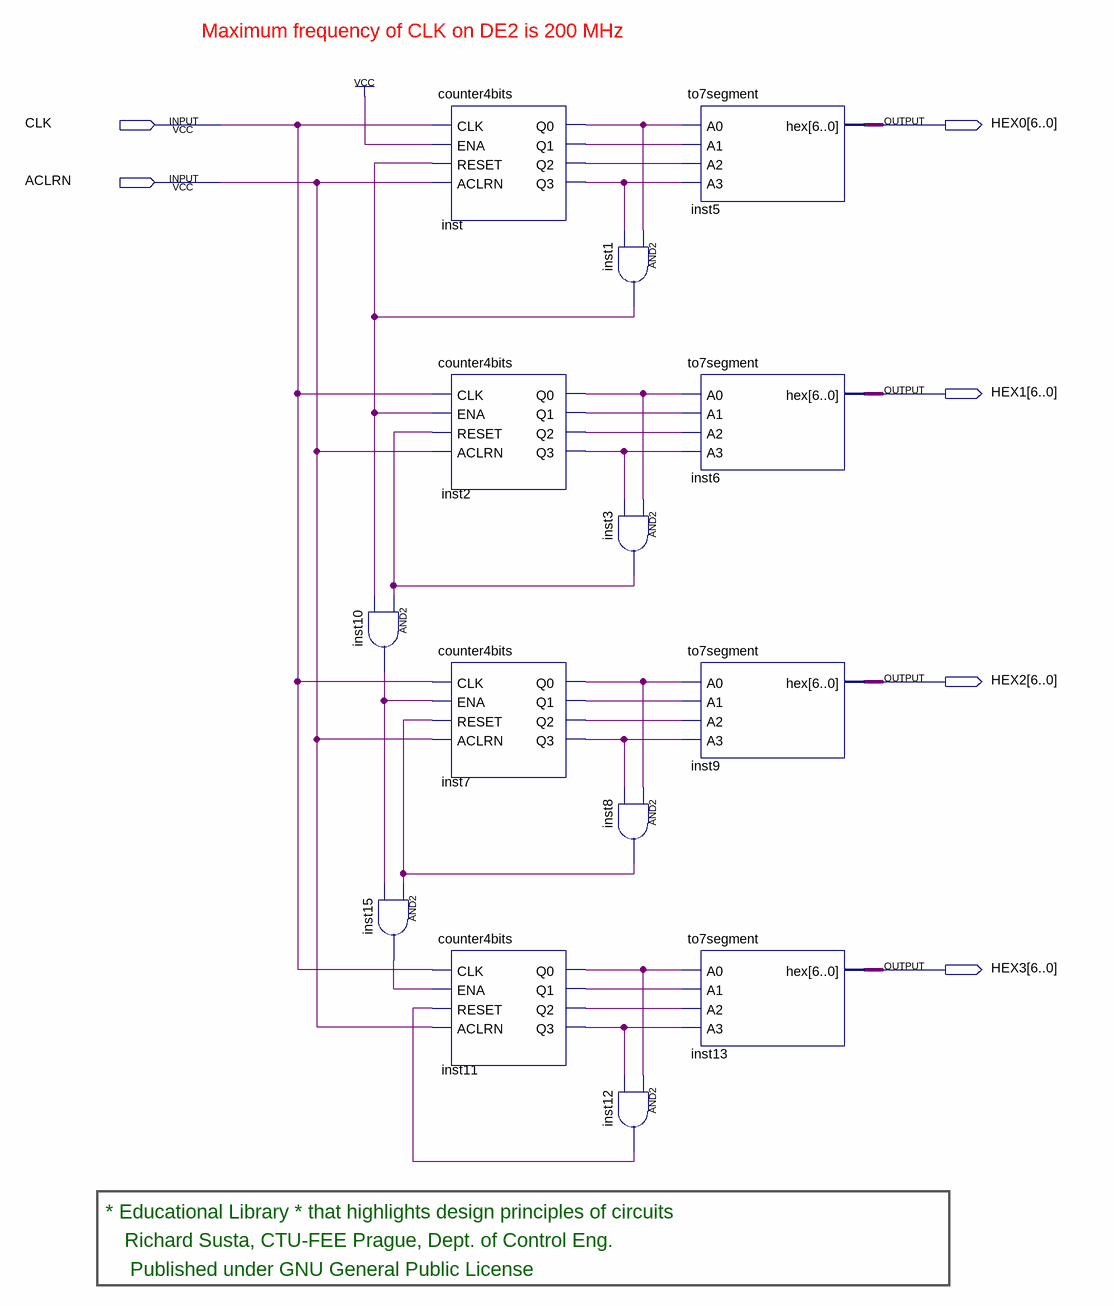
[diagram p0: schematic sheet]
// Quartus schematic counter4BCD.bdf as structural Verilog: 14 symbols, 6 pins
module counter4BCD (
  input  CLK,
  input  ACLRN,
  output [6:0] HEX0,
  output [6:0] HEX1,
  output [6:0] HEX2,
  output [6:0] HEX3
);

  wire inst1_out, inst2_q0, inst2_q1, inst2_q2, inst2_q3, inst3_out, inst7_q0, inst7_q1, inst7_q2, inst7_q3,
       inst8_out, inst10_out, inst11_q0, inst11_q1, inst11_q2, inst11_q3, inst12_out, inst15_out, inst_q0,
       inst_q1, inst_q2, inst_q3;

  and inst10 (inst10_out, inst3_out, inst1_out);
  and inst15 (inst15_out, inst8_out, inst10_out);
  counter4bits inst (
    .CLK(CLK), .ENA(1'b1), .RESET(inst1_out), .ACLRN(ACLRN), .Q0(inst_q0), .Q1(inst_q1), .Q2(inst_q2),
    .Q3(inst_q3));
  counter4bits inst2 (
    .CLK(CLK), .ENA(inst1_out), .RESET(inst3_out), .ACLRN(ACLRN), .Q0(inst2_q0), .Q1(inst2_q1),
    .Q2(inst2_q2), .Q3(inst2_q3));
  counter4bits inst7 (
    .CLK(CLK), .ENA(inst10_out), .RESET(inst8_out), .ACLRN(ACLRN), .Q0(inst7_q0), .Q1(inst7_q1),
    .Q2(inst7_q2), .Q3(inst7_q3));
  counter4bits inst11 (
    .CLK(CLK), .ENA(inst15_out), .RESET(inst12_out), .ACLRN(ACLRN), .Q0(inst11_q0), .Q1(inst11_q1),
    .Q2(inst11_q2), .Q3(inst11_q3));
  and inst1 (inst1_out, inst_q0, inst_q3);
  and inst3 (inst3_out, inst2_q0, inst2_q3);
  and inst8 (inst8_out, inst7_q0, inst7_q3);
  and inst12 (inst12_out, inst11_q0, inst11_q3);
  to7segment inst5 (.A0(inst_q0), .A1(inst_q1), .A2(inst_q2), .A3(inst_q3), .hex(HEX0));
  to7segment inst6 (.A0(inst2_q0), .A1(inst2_q1), .A2(inst2_q2), .A3(inst2_q3), .hex(HEX1));
  to7segment inst9 (.A0(inst7_q0), .A1(inst7_q1), .A2(inst7_q2), .A3(inst7_q3), .hex(HEX2));
  to7segment inst13 (.A0(inst11_q0), .A1(inst11_q1), .A2(inst11_q2), .A3(inst11_q3), .hex(HEX3));

  // Notes on the sheet:
  //   Maximum frequency of CLK on DE2 is 200 MHz
  //   * Educational Library * that highlights design principles of circuits
  //   Richard Susta, CTU-FEE Prague, Dept. of Control Eng. 
  //    Published under GNU General Public License
endmodule
